# EAGLE schematic interface_basic (EAGLE 7.2.0)
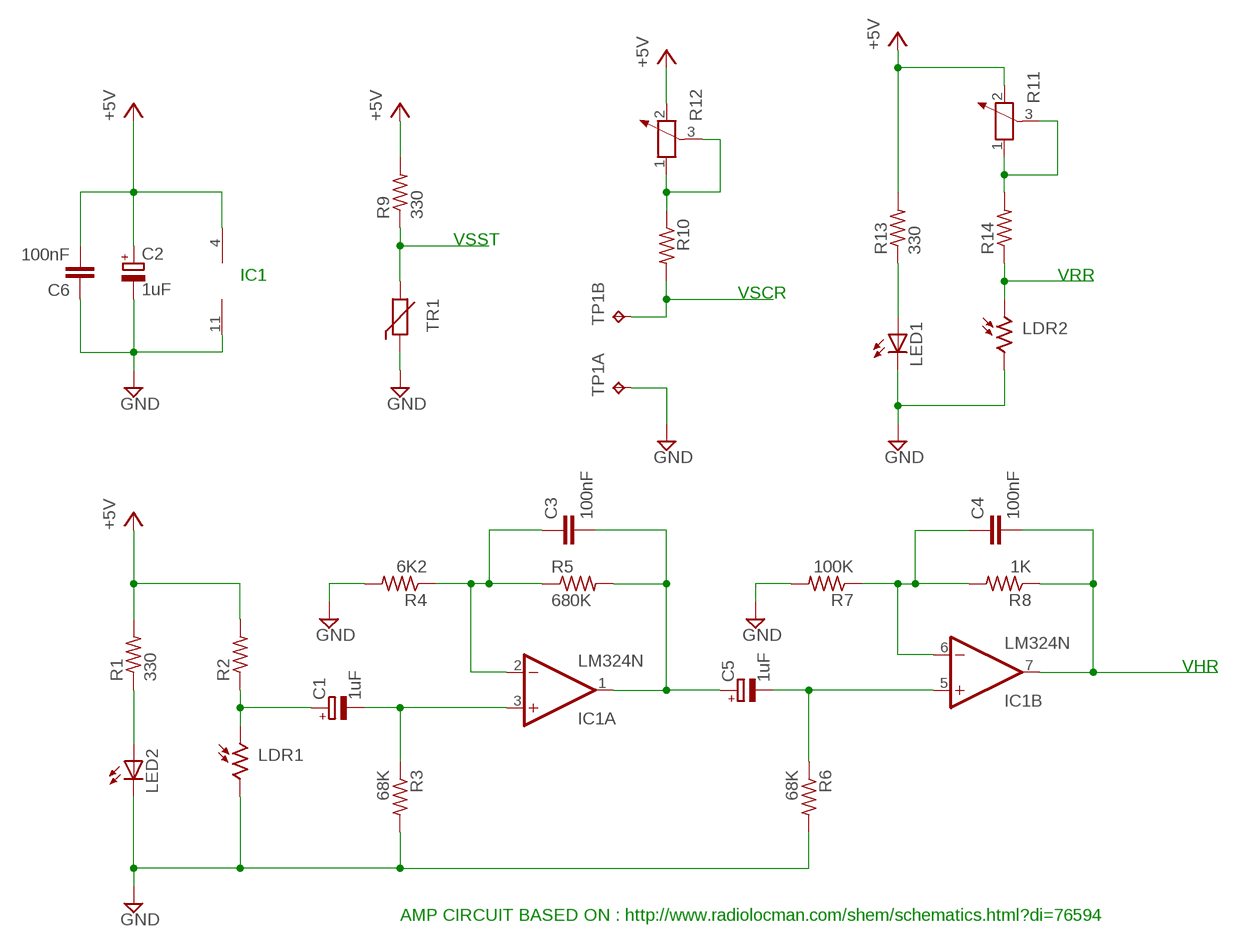
[diagram p0: schematic, sheet 1]

## Parts
C1  1uF  CPOL-EUE2,5-6E  [E2,5-6E]
C2  1uF  CPOL-EUE2,5-6E  [E2,5-6E]
C3  100nF  C-EU050-030X075  [C050-030X075]
C4  100nF  C-EU050-030X075  [C050-030X075]
C5  1uF  CPOL-EUE2,5-6E  [E2,5-6E]
C6  100nF  C-EU050-030X075  [C050-030X075]
IC1  LM324N  [DIL14]
LDR1  A1050_09  [T0-46-A10XX]
LDR2  A1050_09  [T0-46-A10XX]
LED1  LED3MM  [LED3MM]
LED2  LED3MM  [LED3MM]
R1  330  R-US_0309/12  [0309/12]
R2  R-US_0309/12  [0309/12]
R3  68K  R-US_0309/12  [0309/12]
R4  6K2  R-US_0309/12  [0309/12]
R5  680K  R-US_0309/12  [0309/12]
R6  68K  R-US_0309/12  [0309/12]
R7  100K  R-US_0309/12  [0309/12]
R8  1K  R-US_0309/12  [0309/12]
R9  330  R-US_0309/12  [0309/12]
R10  R-US_0309/12  [0309/12]
R11  POTENTIOMETER_PT-10  [PT-10]
R12  POTENTIOMETER_PT-10  [PT-10]
R13  330  R-US_0309/12  [0309/12]
R14  R-US_0309/12  [0309/12]
TP1  TP2P2-38-20  [P2-38-20]
TR1  THERMISTOR_R-2,5  [RS-2,5]

## Nets
GND: C2.- C6.1 IC1.11(P:V-) LDR1.2 LDR2.2 LED1.K(C) LED2.K(C) R3.2 R4.2 R6.2 TP1.TP-1 TR1.1
N$1: C3.2 C5.+ IC1.1(A:OUT) R5.2
N$2: LED2.A R1.1
N$3: C1.+ LDR1.1 R2.1
N$4: C3.1 IC1.2(A:-IN) R4.1 R5.1
N$5: R11.1 R11.3 R14.2
N$6: C5.- IC1.5(B:+IN) R6.1
N$7: C4.1 IC1.6(B:-IN) R7.1 R8.2
N$8: C4.2 IC1.7(B:OUT) R8.1
N$9: C1.- IC1.3(A:+IN) R3.1
N$10: R10.2 TP1.TP-2
N$13: LED1.A R13.1
N$14: LDR2.1 R14.1
N$15: R9.1 TR1.2
N$17: R10.1 R12.1 R12.3
VCC: C2.+ C6.2 IC1.4(P:V+) R1.2 R2.2 R9.2 R11.2 R12.2 R13.2 ; supply symbol labelled +5V
Unconnected: IC1.8(C:OUT) IC1.9(C:-IN) IC1.10(C:+IN) IC1.12(D:+IN) IC1.13(D:-IN) IC1.14(D:OUT) R7.2

## Notes on the sheet
- VSST
- IC1 | VRR
- VSCR
- VHR
- AMP CIRCUIT BASED ON : http://www.radiolocman.com/shem/schematics.html?di=76594

## Library data of the parts
C1 C2 C5 = resistor:CPOL-EU: POLARIZED CAPACITOR, European symbol
C3 C4 C6 = resistor:C-EU: CAPACITOR, European symbol
IC1 = linear:LM324: OP AMP
LDR1 LDR2 = photo-elements:A10: Sensor Robust Light Sensing Applications Outdoor Light Sensing Application Source: http://optoelectronics.perkinelmer.com/content/Datasheets/DTS_PhotocellsA1050.pdf
LED1 LED2 = led:LED: LED OSRAM: - CHIPLED LG R971, LG N971, LY N971, LG Q971, LY Q971, LO R971, LY R971 LH N974, LH R974 LS Q976, LO Q976, LY Q976 LO Q996 - Hyper CHIPLED LW Q18S LB Q993, LB Q99A, LB R99A - SideLED LS A670, LO A670, LY A670, LG A670, LP A670 LB A673, LV A673, LT A673, LW A673 LH A674 LY A675 LS A676, LA A676, LO A676, LY A676, LW A676 LS A679, LY A679, LG A679 - Hyper Micro SIDELED® LS Y876, LA Y876, LO Y876, LY Y876 LT Y87S - SmartLED LW L88C, LW L88S LB L89C, LB L89S, LG L890 LS L89K, LO L89K, LY L89K LS L896, LA L896, LO L896, LY L896 - TOPLED LS T670, LO T670, LY T670, LG T670, LP T670 LSG T670, LSP T670, LSY T670, LOP T670, LYG T670 LG T671, LOG T671, LSG T671 LB T673, LV T673, LT T673, LW T673 LH T674 LS T676, LA T676, LO T676, LY T676, LB T676, LH T676, LSB T676, LW T676 LB T67C, LV T67C, LT T67C, LS T67K, LO T67K, LY T67K, LW E67C LS E67B, LA E67B, LO E67B, LY E67B, LB E67C, LV E67C, LT E67C LW T67C LS T679, LY T679, LG T679 LS T770, LO T770, LY T770, LG T770, LP T770 LB T773, LV T773, LT T773, LW T773 LH T774 LS E675, LA E675, LY E675, LS T675 LS T776, LA T776, LO T776, LY T776, LB T776 LHGB T686 LT T68C, LB T68C - Hyper Mini TOPLED® LB M676 - Mini TOPLED Santana® LG M470 LS M47K, LO M47K, LY M47K Source: http://www.osram.convergy.de LUXEON: - LUMILED® LXK2-PW12-R00, LXK2-PW12-S00, LXK2-PW14-U00, LXK2-PW14-V00 LXK2-PM12-R00, LXK2-PM12-S00, LXK2-PM14-U00 LXK2-PE12-Q00, LXK2-PE12-R00, LXK2-PE12-S00, LXK2-PE14-T00, LXK2-PE14-U00 LXK2-PB12-K00, LXK2-PB12-L00, LXK2-PB12-M00, LXK2-PB14-N00, LXK2-PB14-P00, LXK2-PB14-Q00 LXK2-PR12-L00, LXK2-PR12-M00, LXK2-PR14-Q00, LXK2-PR14-R00 LXK2-PD12-Q00, LXK2-PD12-R00, LXK2-PD12-S00 LXK2-PH12-R00, LXK2-PH12-S00 LXK2-PL12-P00, LXK2-PL12-Q00, LXK2-PL12-R00 Source: www.luxeon.com KINGBRIGHT: KA-3528ASYC Source: www.kingbright.com
R1-R10 R13 R14 = resistor:R-US_: RESISTOR, American symbol
R11 R12 = rcl:POTENTIOMETER_: Potentiometer
TP1 = testpad:TP2: Test pad
TR1 = discrete:THERMISTOR_: Thermo Resistor